# EasyEDA Pro project STM32H750VBT6_USB3300.eprj

# Schematic Schematic1
Create Date: 2023-07-06; Page Name: P1; Project Name: STM32H750VBT6_USB3300; Schematic Name: Schematic1; Update Date: 2023-07-07; Company: 嘉立创EDA; Page Size: A4; Version: V1.0
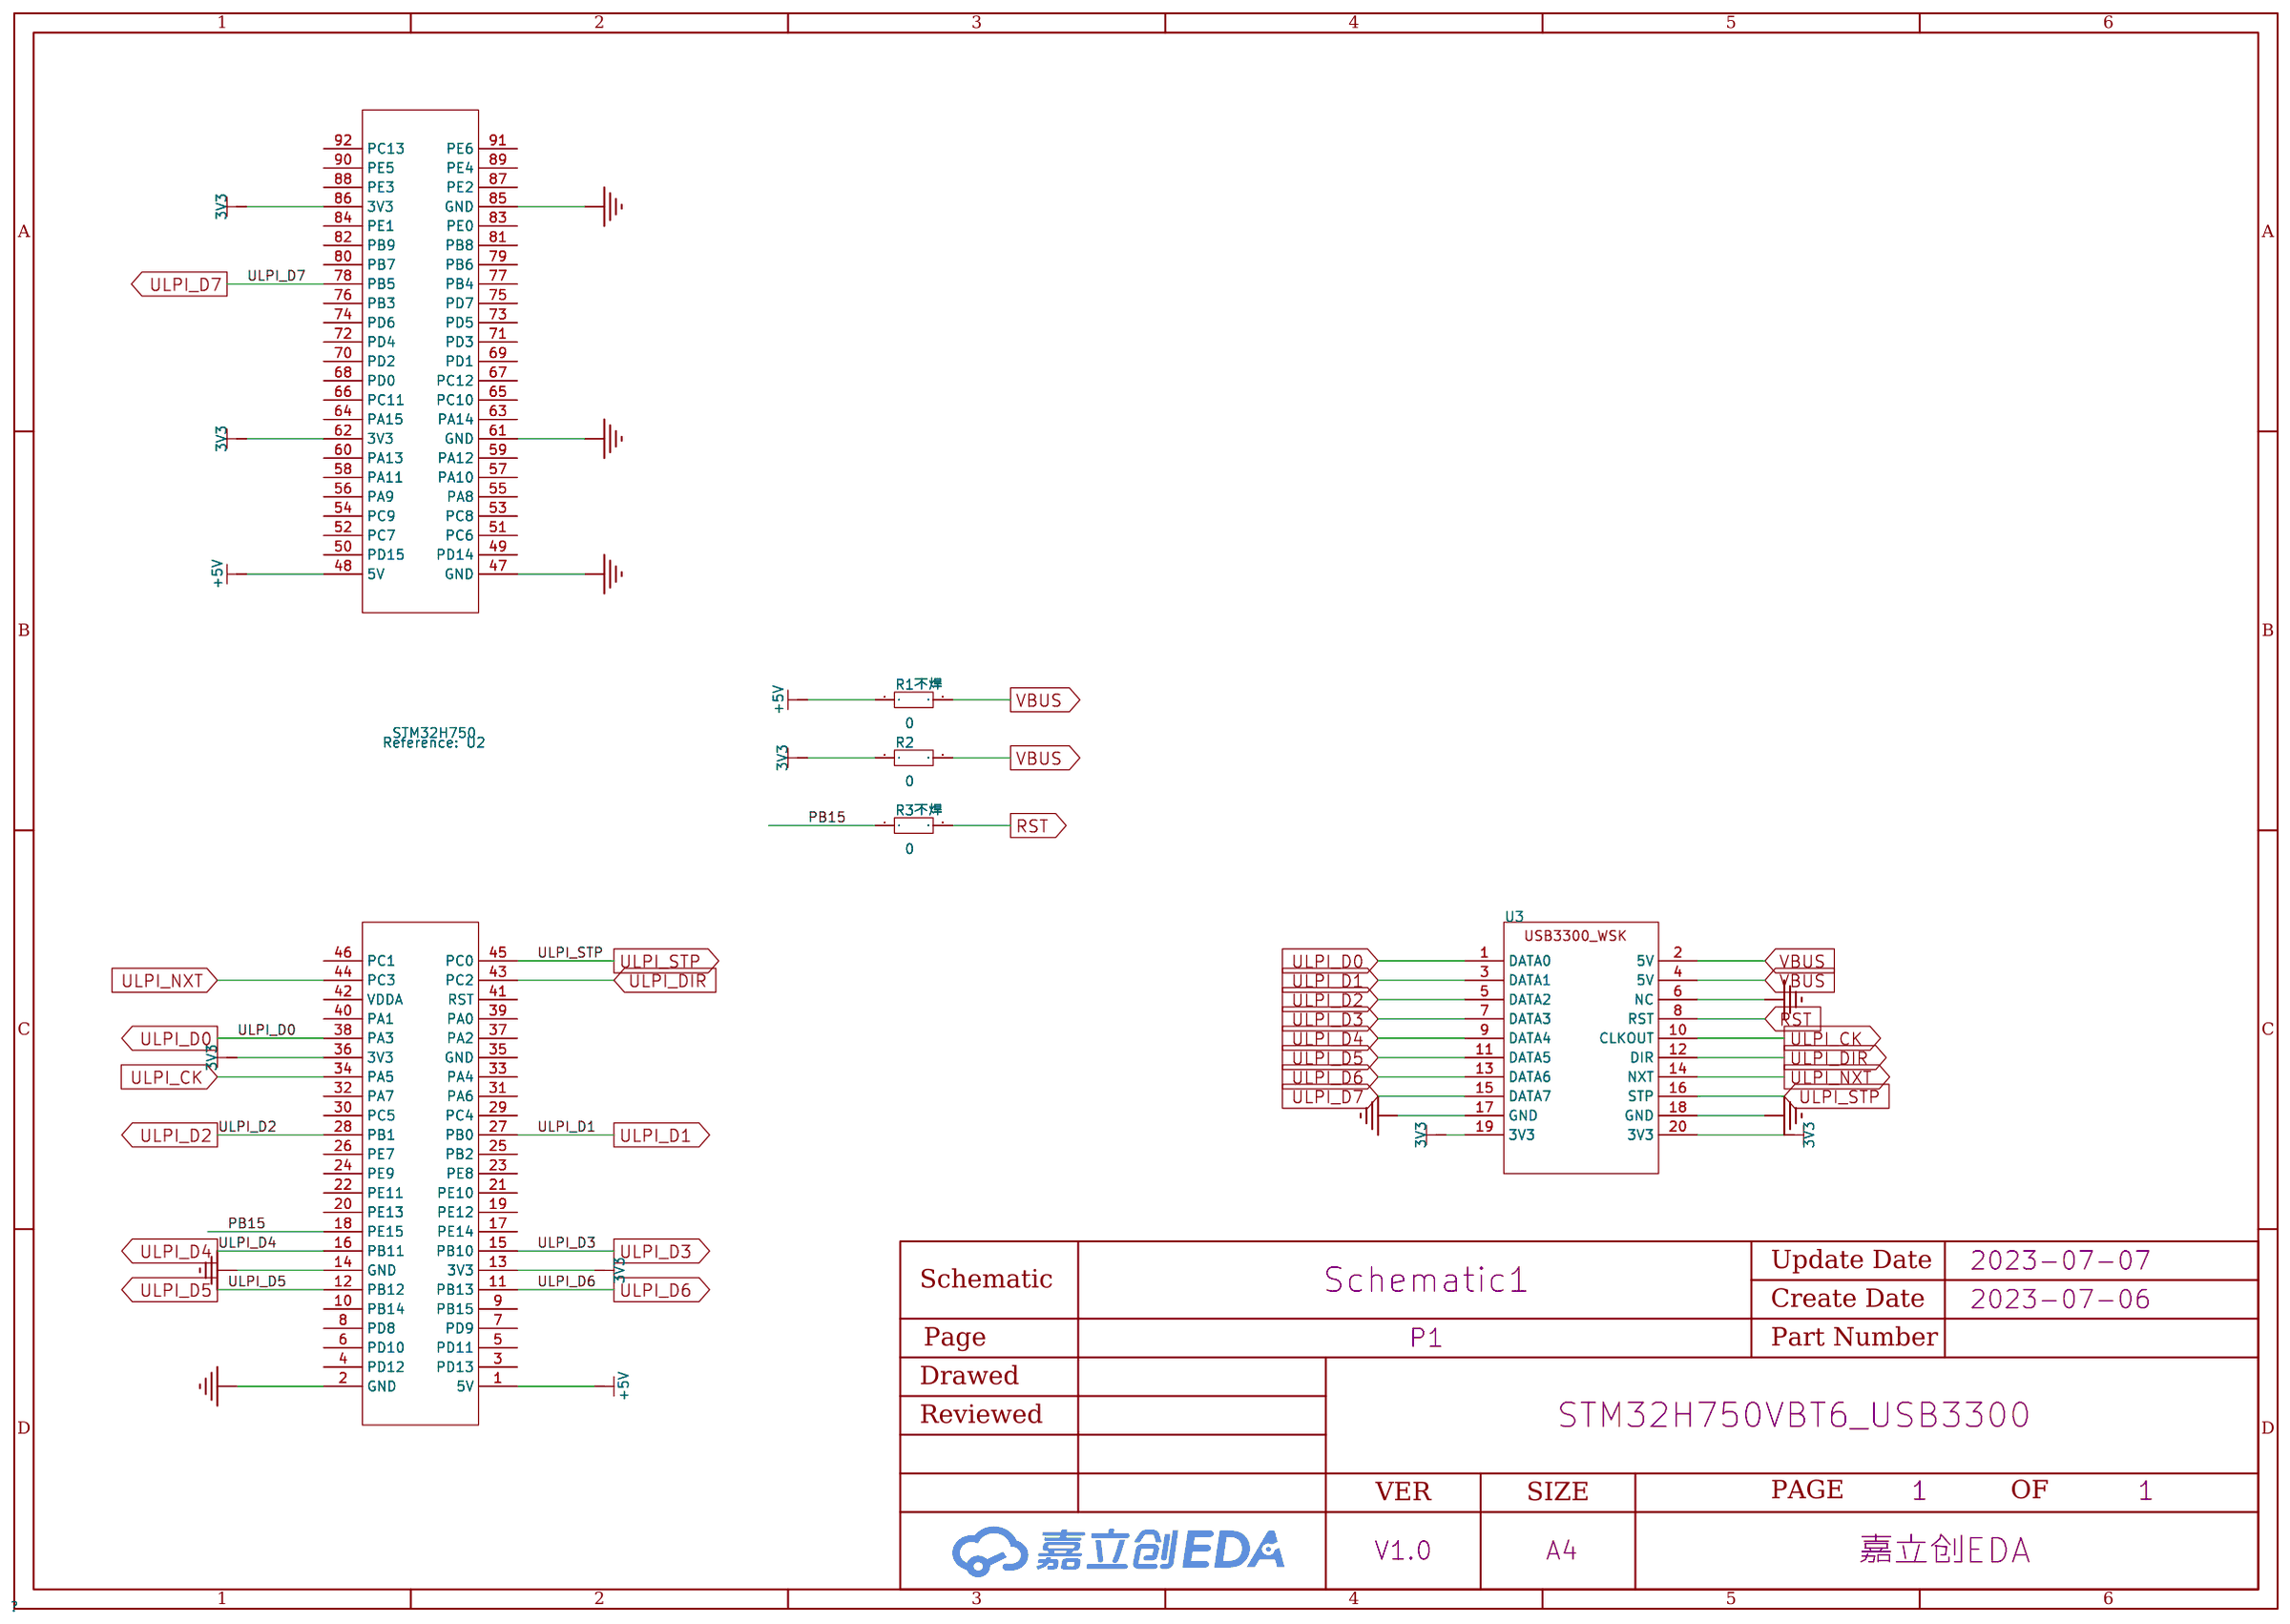
[diagram p0: schematic sheet]

## Parts
R1不焊  0  [R0603]
R2  0  [R0603]
R3不焊  0  [R0603]
U2  STM32H750  [STM32H750VBT6_ bottom_board]
U3  -  [USB3300_wireshark]

## Library data of the parts
R1不焊 R2 R3不焊 = Res_0603: Supplier Footprint: 0603
U2 = STM32H750VBT6: STM32H750VBT6核心板
U3 = USB3300_wireshark: 微雪USB3300 ULPI接口模块

## Nets
3V3: R2.1 U2.13(3V3) U2.36(3V3) U2.62(3V3) U2.86(3V3) U3.19(3V3) U3.20(3V3)
+5V: R1不焊.1 U2.1(5V) U2.48(5V)
GND: U2.2(GND) U2.14(GND) U2.47(GND) U2.61(GND) U2.85(GND) U3.6(NC) U3.17(GND) U3.18(GND)
VBUS: R1不焊.2 R2.2 U3.2(5V) U3.4(5V)
PB15: R3不焊.1 U2.18(PE15)
RST: R3不焊.2 U3.8(RST)
ULPI_CK: U2.34(PA5) U3.10(CLKOUT)
ULPI_D0: U2.38(PA3) U3.1(DATA0)
ULPI_D1: U2.27(PB0) U3.3(DATA1)
ULPI_D2: U2.28(PB1) U3.5(DATA2)
ULPI_D3: U2.15(PB10) U3.7(DATA3)
ULPI_D4: U2.16(PB11) U3.9(DATA4)
ULPI_D5: U2.12(PB12) U3.11(DATA5)
ULPI_D6: U2.11(PB13) U3.13(DATA6)
ULPI_D7: U2.78(PB5) U3.15(DATA7)
ULPI_DIR: U2.43(PC2) U3.12(DIR)
ULPI_NXT: U2.44(PC3) U3.14(NXT)
ULPI_STP: U2.45(PC0) U3.16(STP)

Not connected (* = marked no-connect by the designer): U2 3(PD13) 4(PD12) 5(PD11) 6(PD10) 7(PD9) 8(PD8) 9(PB15) 10(PB14) 17(PE14) 19(PE12) 20(PE13) 21(PE10) 22(PE11) 23(PE8) 24(PE9) 25(PB2) 26(PE7) 29(PC4) 30(PC5) 31(PA6) 32(PA7) 33(PA4) 35(GND) 37(PA2) 39(PA0) 40(PA1) 41(RST) 42(VDDA) 46(PC1) 49(PD14) 50(PD15) 51(PC6) 52(PC7) 53(PC8) 54(PC9) 55(PA8) 56(PA9) 57(PA10) 58(PA11) 59(PA12) 60(PA13) 63(PA14) 64(PA15) 65(PC10) 66(PC11) 67(PC12) 68(PD0) 69(PD1) 70(PD2) 71(PD3) 72(PD4) 73(PD5) 74(PD6) 75(PD7) 76(PB3) 77(PB4) 79(PB6) 80(PB7) 81(PB8) 82(PB9) 83(PE0) 84(PE1) 87(PE2) 88(PE3) 89(PE4) 90(PE5) 91(PE6) 92(PC13)

# Board PCB1
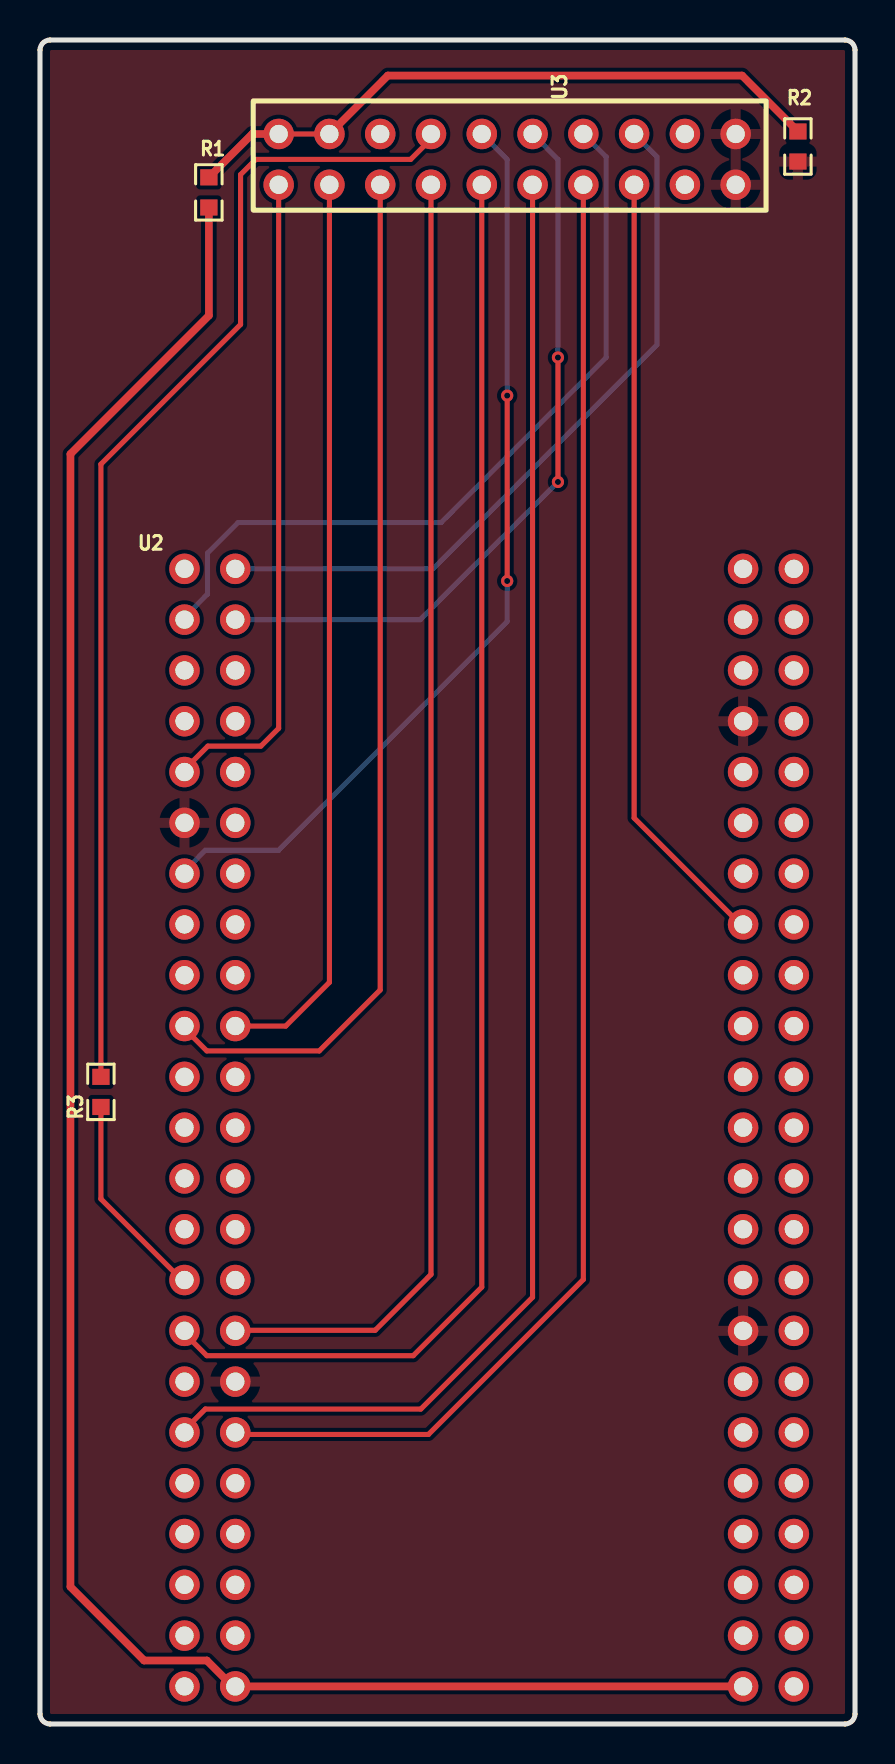
[diagram p1: board, top side]
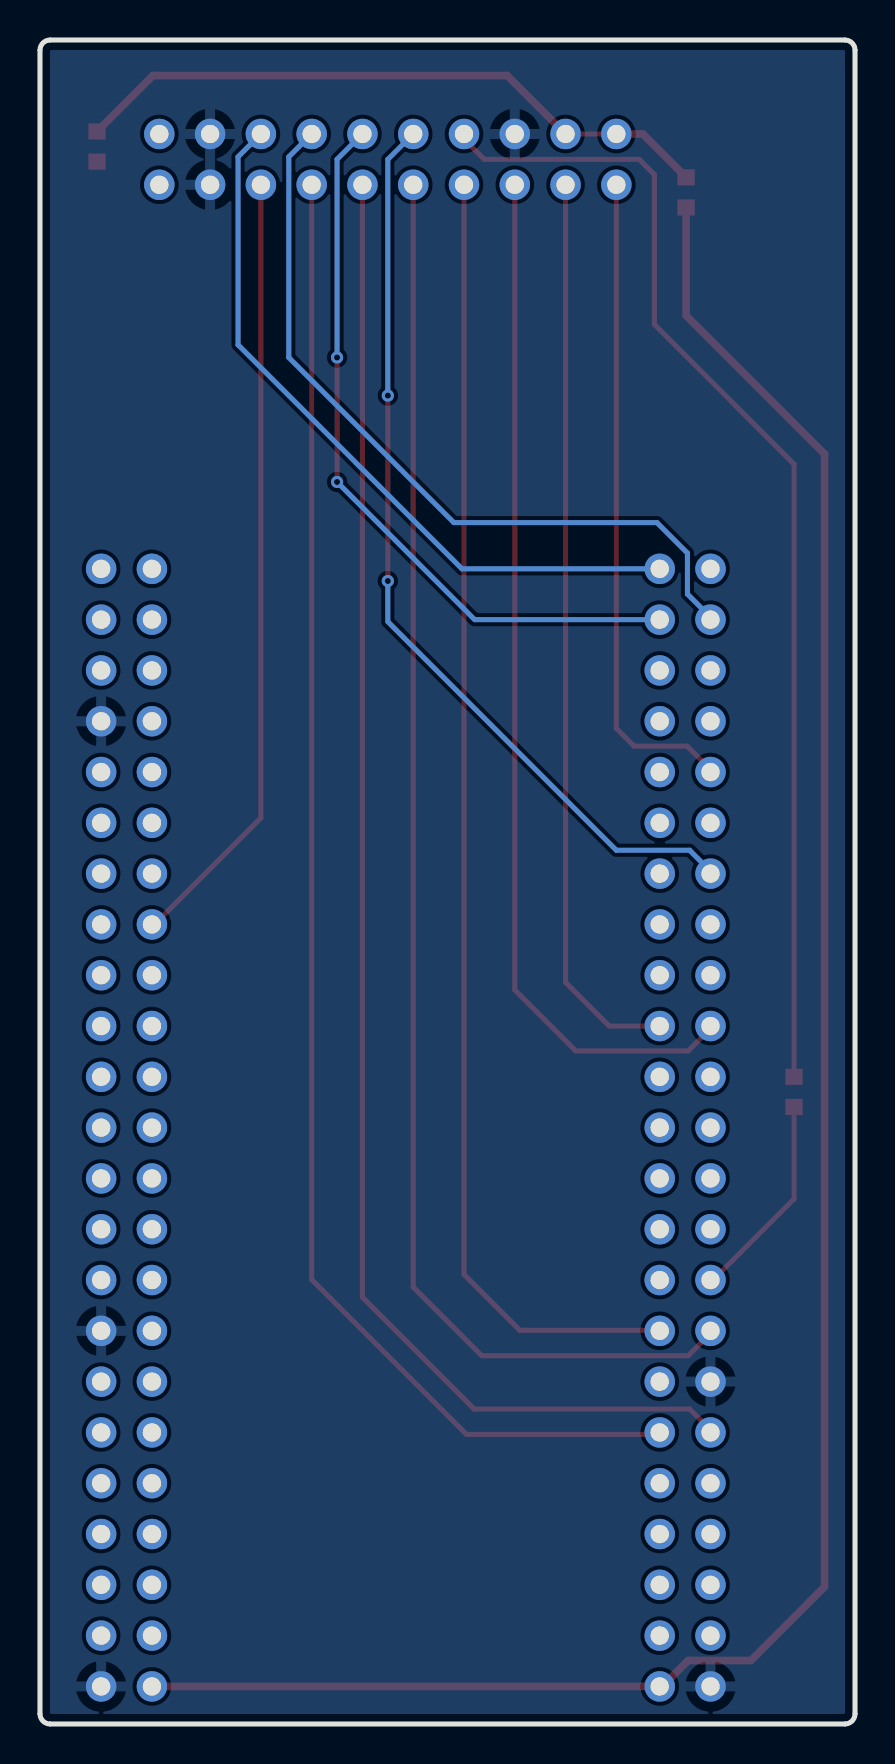
[diagram p2: board, bottom side, seen from below]

Outline 40.77 x 84.2 mm; copper layers: Top Layer, Bottom Layer. Coordinates in mm from the lower left corner of the outline.
Outline path: 0,83.69 0,0.51 arc(0.15,0.15) 0.51,0 40.26,0 arc(40.62,0.15) 40.77,0.51 40.77,83.69 arc(40.62,84.05) 40.26,84.2 0.51,84.2 arc(0.15,84.05) 0,83.69
Stack: Top Layer 0.035mm / Dielectric1 1.51mm FR4 er 4.5 / Bottom Layer 0.035mm

## Design rules (mm)
template: JLCPCB Capability(Two Layers Board)
spacing copperThickness1oz (default): track to track 0.102, other pairs 0.152 to 0.3
spacing copperThickness2oz: track to track 0.203, other pairs 0.152 to 0.3
track width copperThickness1oz (default): min 0.127, default 0.254, max 2.54
track width copperThickness2oz: min 0.203, default 0.254, max 2.54
differential pair differentialPair (default): width min 0.127, default 0.254, max 2.54; gap min 0.152, default 0.152
via viaSize (default): diameter min 0.5, default 0.61, max 10; hole min 0.3, default 0.305, max 6.3

## Placement (name value [footprint] x y rotation side)
R1  0  [R0603]  8.45 76.58 90 top
R2  0  [R0603]  37.91 78.88 90 top
R3  0  [R0603]  3.05 31.61 90 top
U2  STM32H750  [STM32H750VBT6_ bottom_board]  22.1 31.12 0 top
U3  -  [USB3300_wireshark]  23.37 78.23 270 top

## Footprints (pads in the part's own frame, mm; a bottom-side part is the same pattern mirrored in y, then rotated)
R0603
  rect 0.806x0.864 smd: 1(-0.753,0) 2(0.753,0)
STM32H750VBT6_ bottom_board
  round 1.524 hole 0.914: 1(-12.329,-29.236) 2(-14.87,-29.236) 3(-12.329,-26.697) 4(-14.87,-26.697) 5(-12.329,-24.157) 6(-14.87,-24.157) 7(-12.329,-21.616) 8(-14.87,-21.616) 9(-12.329,-19.076) 10(-14.87,-19.076) 11(-12.329,-16.537) 12(-14.87,-16.537) 13(-12.329,-13.996) 14(-14.87,-13.996) 15(-12.329,-11.457) 16(-14.87,-11.457) 17(-12.329,-8.916) 18(-14.87,-8.916) 19(-12.329,-6.377) 20(-14.87,-6.377) 21(-12.329,-3.837) 22(-14.87,-3.837) 23(-12.329,-1.296) 24(-14.87,-1.296) 25(-12.329,1.244) 26(-14.87,1.244) 27(-12.329,3.784) 28(-14.87,3.784) 29(-12.329,6.324) 30(-14.87,6.324) 31(-12.329,8.864) 32(-14.87,8.864) 33(-12.329,11.403) 34(-14.87,11.403) 35(-12.329,13.944) 36(-14.87,13.944) 37(-12.329,16.483) 38(-14.87,16.483) 39(-12.329,19.023) 40(-14.87,19.023) 41(-12.329,21.564) 42(-14.87,21.564) 43(-12.329,24.104) 44(-14.87,24.104) 45(-12.329,26.643) 46(-14.87,26.643) 47(15.611,-29.236) 48(13.07,-29.236) 49(15.611,-26.697) 50(13.07,-26.697) 51(15.611,-24.157) 52(13.07,-24.157) 53(15.611,-21.616) 54(13.07,-21.616) 55(15.611,-19.076) 56(13.07,-19.076) 57(15.611,-16.537) 58(13.07,-16.537) 59(15.611,-13.996) 60(13.07,-13.996) 61(15.611,-11.457) 62(13.07,-11.457) 63(15.611,-8.916) 64(13.07,-8.916) 65(15.611,-6.377) 66(13.07,-6.377) 67(15.611,-3.837) 68(13.07,-3.837) 69(15.611,-1.296) 70(13.07,-1.296) 71(15.611,1.244) 72(13.07,1.244) 73(15.611,3.784) 74(13.07,3.784) 75(15.611,6.324) 76(13.07,6.324) 77(15.611,8.864) 78(13.07,8.864) 79(15.611,11.403) 80(13.07,11.403) 81(15.611,13.944) 82(13.07,13.944) 83(15.611,16.483) 84(13.07,16.483) 85(15.611,19.023) 86(13.07,19.023) 87(15.611,21.564) 88(13.07,21.564) 89(15.611,24.104) 90(13.07,24.104) 91(15.611,26.643) 92(13.07,26.643)
USB3300_wireshark
  round 1.524 hole 0.914: 1(1.27,-11.43) 2(-1.27,-11.43) 3(1.27,-8.89) 4(-1.27,-8.89) 5(1.27,-6.35) 6(-1.27,-6.35) 7(1.27,-3.81) 8(-1.27,-3.81) 9(1.27,-1.27) 10(-1.27,-1.27) 11(1.27,1.27) 12(-1.27,1.27) 13(1.27,3.81) 14(-1.27,3.81) 15(1.27,6.35) 16(-1.27,6.35) 17(1.27,8.89) 18(-1.27,8.89) 19(1.27,11.43) 20(-1.27,11.43)

## Nets
3V3: R2.1 U2.13 U2.36 U2.62 U2.86 U3.19 U3.20
+5V: R1.1 U2.1 U2.48
GND: U2.2 U2.14 U2.47 U2.61 U2.85 U3.6 U3.17 U3.18
VBUS: R1.2 R2.2 U3.2 U3.4
PB15: R3.1 U2.18
RST: R3.2 U3.8
ULPI_CK: U2.34 U3.10
ULPI_D0: U2.38 U3.1
ULPI_D1: U2.27 U3.3
ULPI_D2: U2.28 U3.5
ULPI_D3: U2.15 U3.7
ULPI_D4: U2.16 U3.9
ULPI_D5: U2.12 U3.11
ULPI_D6: U2.11 U3.13
ULPI_D7: U2.78 U3.15
ULPI_DIR: U2.43 U3.12
ULPI_NXT: U2.44 U3.14
ULPI_STP: U2.45 U3.16

Pads without a net: U2 3 4 5 6 7 8 9 10 17 19 20 21 22 23 24 25 26 29 30 31 32 33 35 37 39 40 41 42 46 49 50 51 52 53 54 55 56 57 58 59 60 63 64 65 66 67 68 69 70 71 72 73 74 75 76 77 79 80 81 82 83 84 87 88 89 90 91 92

## Via types
v1: diameter 0.61, hole 0.305, Top Layer to Bottom Layer, 4 vias

## Routing (per net, layer and track width the routed paths; a pad name or vN(x,y) marks a point on that pad's centre or on a via; arc(x,y) is an arc through that point)
+5V: length 107.4
  Top Layer w0.381: R1.1 8.45,70.42 1.52,63.5 1.52,6.86 5.21,3.18 8.34,3.18 9.64,1.88 35.04,1.88
VBUS: length 32.7
  Top Layer w0.254: U3.4 U3.2
  Top Layer w0.381: U3.4 17.4,82.42 35.12,82.42 37.91,79.63 ; U3.2 10.62,79.5 R1.2
PB15: length 10.3
  Top Layer w0.254: R3.1 3.05,26.25 7.1,22.2
RST: length 58.5
  Top Layer w0.254: R3.2 3.05,62.99 10.03,69.98 10.03,77.47 10.8,78.23 18.54,78.23 19.56,79.25 U3.8
ULPI_CK: length 46.4
  Top Layer w0.254: v1(23.37,66.42) v1(23.37,57.15)
  Bottom Layer w0.254: 7.1,42.52 8.27,43.69 11.94,43.69 23.37,55.12 v1(23.37,57.15) ; v1(23.37,66.42) 23.37,78.23 U3.10
ULPI_D0: length 32.9
  Top Layer w0.254: 7.1,47.6 8.4,48.9 11.05,48.9 11.94,49.78 U3.1
ULPI_D1: length 45.6
  Top Layer w0.254: U3.3 14.48,37.08 12.29,34.9 9.64,34.9
ULPI_D2: length 52
  Top Layer w0.254: U3.5 17.02,36.7 13.97,33.66 8.34,33.66 7.1,34.9
ULPI_D3: length 65.6
  Top Layer w0.254: U3.7 19.56,22.48 16.76,19.69 9.67,19.69 9.64,19.66
ULPI_D4: length 72
  Top Layer w0.254: U3.9 22.1,21.84 18.67,18.42 8.34,18.42 7.1,19.66
ULPI_D5: length 76
  Top Layer w0.254: U3.11 24.64,21.34 19.05,15.75 8.27,15.75 7.1,14.58
ULPI_D6: length 75.5
  Top Layer w0.254: U3.13 27.18,22.23 19.43,14.48 9.74,14.48 9.64,14.58
ULPI_D7: length 39.2
  Top Layer w0.254: 35.04,39.98 29.72,45.3 U3.15
ULPI_DIR: length 37
  Top Layer w0.254: v1(25.91,68.33) v1(25.91,62.1)
  Bottom Layer w0.254: v1(25.91,68.33) 25.91,78.23 U3.12 ; 9.64,55.22 19.02,55.22 v1(25.91,62.1)
ULPI_NXT: length 39.5
  Bottom Layer w0.254: 7.1,55.22 8.38,56.5 8.38,58.55 9.91,60.07 20.07,60.07 28.32,68.33 28.32,78.36 U3.14
ULPI_STP: length 36.9
  Bottom Layer w0.254: U3.16 30.86,78.36 30.86,68.96 19.66,57.76 9.64,57.76

## Copper pours and planes (outline as drawn; the poured copper is in the pictures)
3V3 on Top Layer: -0.13,84.33 40.77,84.33 40.77,-0.13 -0.13,-0.13
GND on Bottom Layer: -0.13,84.33 40.77,84.33 40.77,-0.13 -0.13,-0.13
